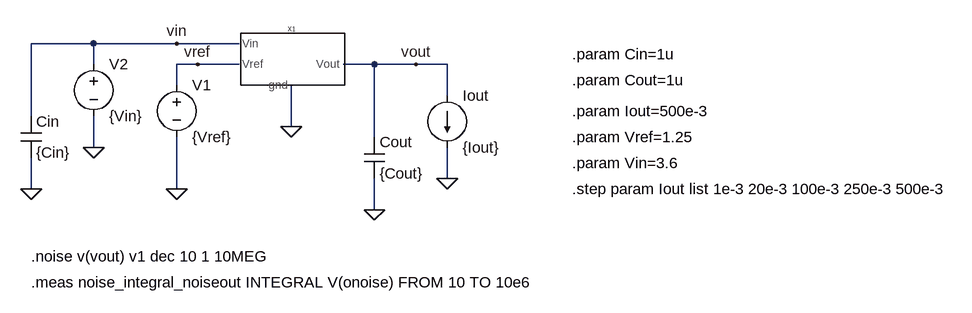
[diagram p0: schematic Noise_6p40.asc]
Noise_6p40.asc, the LTspice schematic file:
Version 4
SHEET 1 880 680
WIRE -528 -160 -624 -160
WIRE -400 -160 -528 -160
WIRE -304 -160 -400 -160
WIRE -528 -128 -528 -160
WIRE -368 -128 -400 -128
WIRE -304 -128 -368 -128
WIRE -96 -128 -144 -128
WIRE -32 -128 -96 -128
WIRE 16 -128 -32 -128
WIRE -400 -96 -400 -128
WIRE 16 -80 16 -128
WIRE -624 -48 -624 -160
WIRE -224 -32 -224 -96
WIRE -96 -16 -96 -128
WIRE -528 0 -528 -48
WIRE 16 48 16 0
WIRE -624 64 -624 16
WIRE -400 64 -400 -16
WIRE -96 96 -96 48
FLAG -368 -128 vref
FLAG -528 0 0
FLAG -400 -160 vin
FLAG -96 96 0
FLAG 16 48 0
FLAG -32 -128 vout
FLAG -224 -32 0
FLAG -624 64 0
FLAG -400 64 0
SYMBOL LDO_basic -224 -144 R0
SYMATTR InstName X1
SYMBOL voltage -400 -112 R0
WINDOW 123 0 0 Left 0
WINDOW 39 0 0 Left 0
SYMATTR InstName V1
SYMATTR Value {Vref}
SYMBOL voltage -528 -144 R0
WINDOW 123 24 44 Left 2
WINDOW 39 0 0 Left 0
SYMATTR InstName V2
SYMATTR Value {Vin}
SYMBOL cap -112 -16 R0
SYMATTR InstName Cout
SYMATTR Value {Cout}
SYMBOL current 16 -80 R0
WINDOW 123 0 0 Left 0
WINDOW 39 0 0 Left 0
SYMATTR InstName Iout
SYMATTR Value {Iout}
SYMBOL cap -640 -48 R0
SYMATTR InstName Cin
SYMATTR Value {Cin}
TEXT -624 168 Left 2 !.noise v(vout) v1 dec 10 1 10MEG
TEXT 208 -56 Left 2 !.param Iout=500e-3
TEXT 208 -104 Left 2 !.param Cout=1u
TEXT 208 -144 Left 2 !.param Cin=1u
TEXT 208 -16 Left 2 !.param Vref=1.25
TEXT 208 24 Left 2 !.param Vin=3.6
TEXT -624 208 Left 2 !.meas noise_integral_noiseout INTEGRAL V(onoise) FROM 10 TO 10e6
TEXT 208 64 Left 2 !.step param Iout list 1e-3 20e-3 100e-3 250e-3 500e-3

The netlist it stands for:
* Noise_6p40.asc
XX1 vin vref 0 vout LDO_basic  ; pins Vin Vref gnd Vout
V1 vref 0 {Vref}
V2 vin 0 {Vin}
Cout vout 0 {Cout}
Iout vout 0 {Iout}
Cin vin 0 {Cin}
.noise v(vout) v1 dec 10 1 10MEG
.param Iout=500e-3
.param Cout=1u
.param Cin=1u
.param Vref=1.25
.param Vin=3.6
.meas noise_integral_noiseout INTEGRAL V(onoise) FROM 10 TO 10e6
.step param Iout list 1e-3 20e-3 100e-3 250e-3 500e-3
.backanno
.end